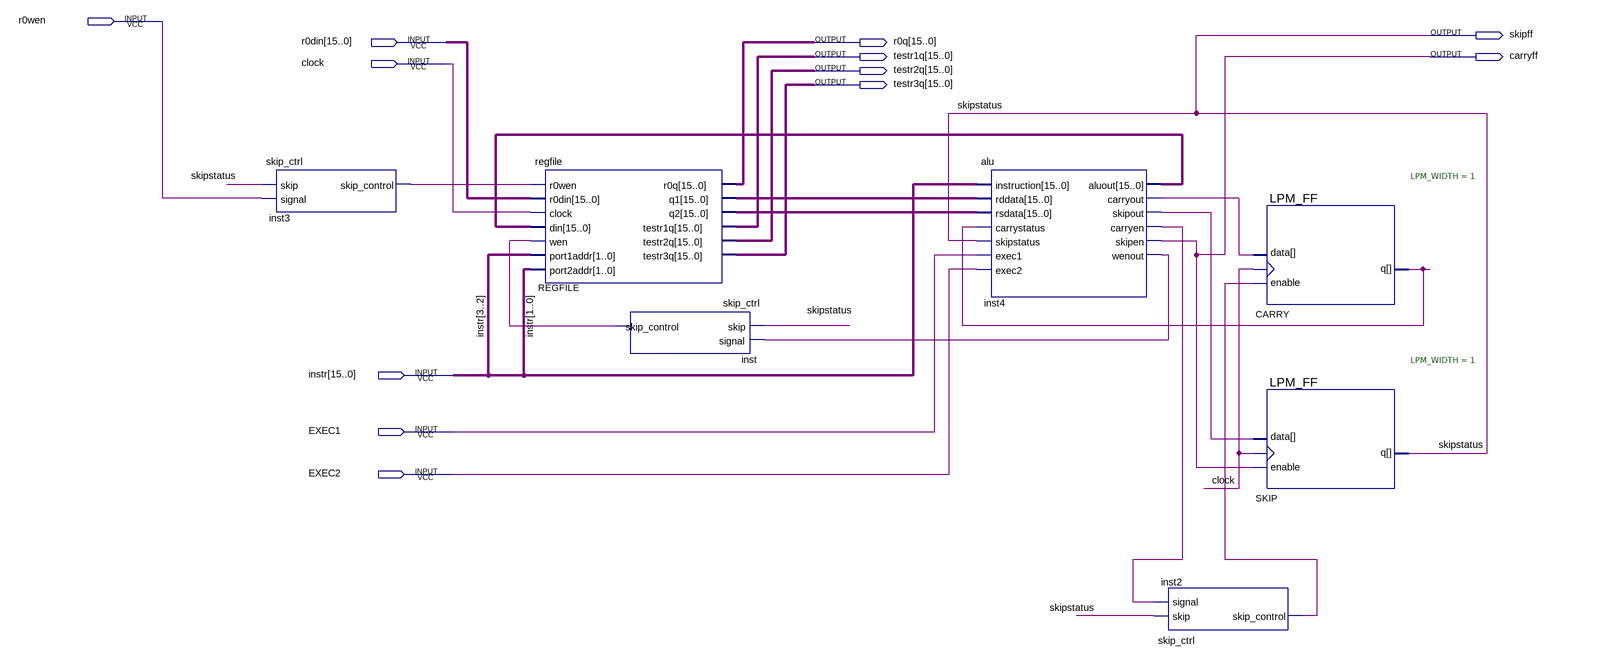
[diagram p0: schematic sheet]
// Quartus schematic top.bdf as structural Verilog: 7 symbols, 12 pins
module top (
  input  r0wen,
  input  [15:0] r0din,
  input  clock,
  input  [15:0] instr,
  input  EXEC1,
  input  EXEC2,
  output skipff,
  output [15:0] r0q,
  output [15:0] testr1q,
  output carryff,
  output [15:0] testr2q,
  output [15:0] testr3q
);

  wire CARRY_q, inst2_skip_control, inst3_skip_control, inst4_carryen, inst4_carryout, inst4_skipout,
       inst4_wenout, inst_skip_control;
  wire [15:0] inst4_aluout, REGFILE_q1, REGFILE_q2;

  skip_ctrl inst3 (.skip(skipff), .signal(r0wen), .skip_control(inst3_skip_control));
  regfile REGFILE (
    .r0wen(inst3_skip_control), .r0din(r0din), .clock(clock), .din(inst4_aluout), .wen(inst_skip_control),
    .port1addr(instr[3:2]), .port2addr(instr[1:0]), .r0q(r0q), .q1(REGFILE_q1), .q2(REGFILE_q2),
    .testr1q(testr1q), .testr2q(testr2q), .testr3q(testr3q));
  skip_ctrl inst (.skip(skipff), .signal(inst4_wenout), .skip_control(inst_skip_control));
  alu inst4 (
    .instruction(instr), .rddata(REGFILE_q1), .rsdata(REGFILE_q2), .carrystatus(CARRY_q),
    .skipstatus(skipff), .exec1(EXEC1), .exec2(EXEC2), .aluout(inst4_aluout), .carryout(inst4_carryout),
    .skipout(inst4_skipout), .carryen(inst4_carryen), .skipen(carryff), .wenout(inst4_wenout));
  skip_ctrl inst2 (.skip(skipff), .signal(inst4_carryen), .skip_control(inst2_skip_control));
  LPM_FF #(.LPM_WIDTH(1)) CARRY (.clock(clock), .data(inst4_carryout), .enable(inst2_skip_control), .q(CARRY_q));
  LPM_FF #(.LPM_WIDTH(1)) SKIP (.clock(clock), .data(inst4_skipout), .enable(carryff), .q(skipff));

  // Other names for the same wires on the sheet: skipstatus = skipff
endmodule
